# EAGLE schematic 3x8ButV1.3.6 (EAGLE 6.6.0)
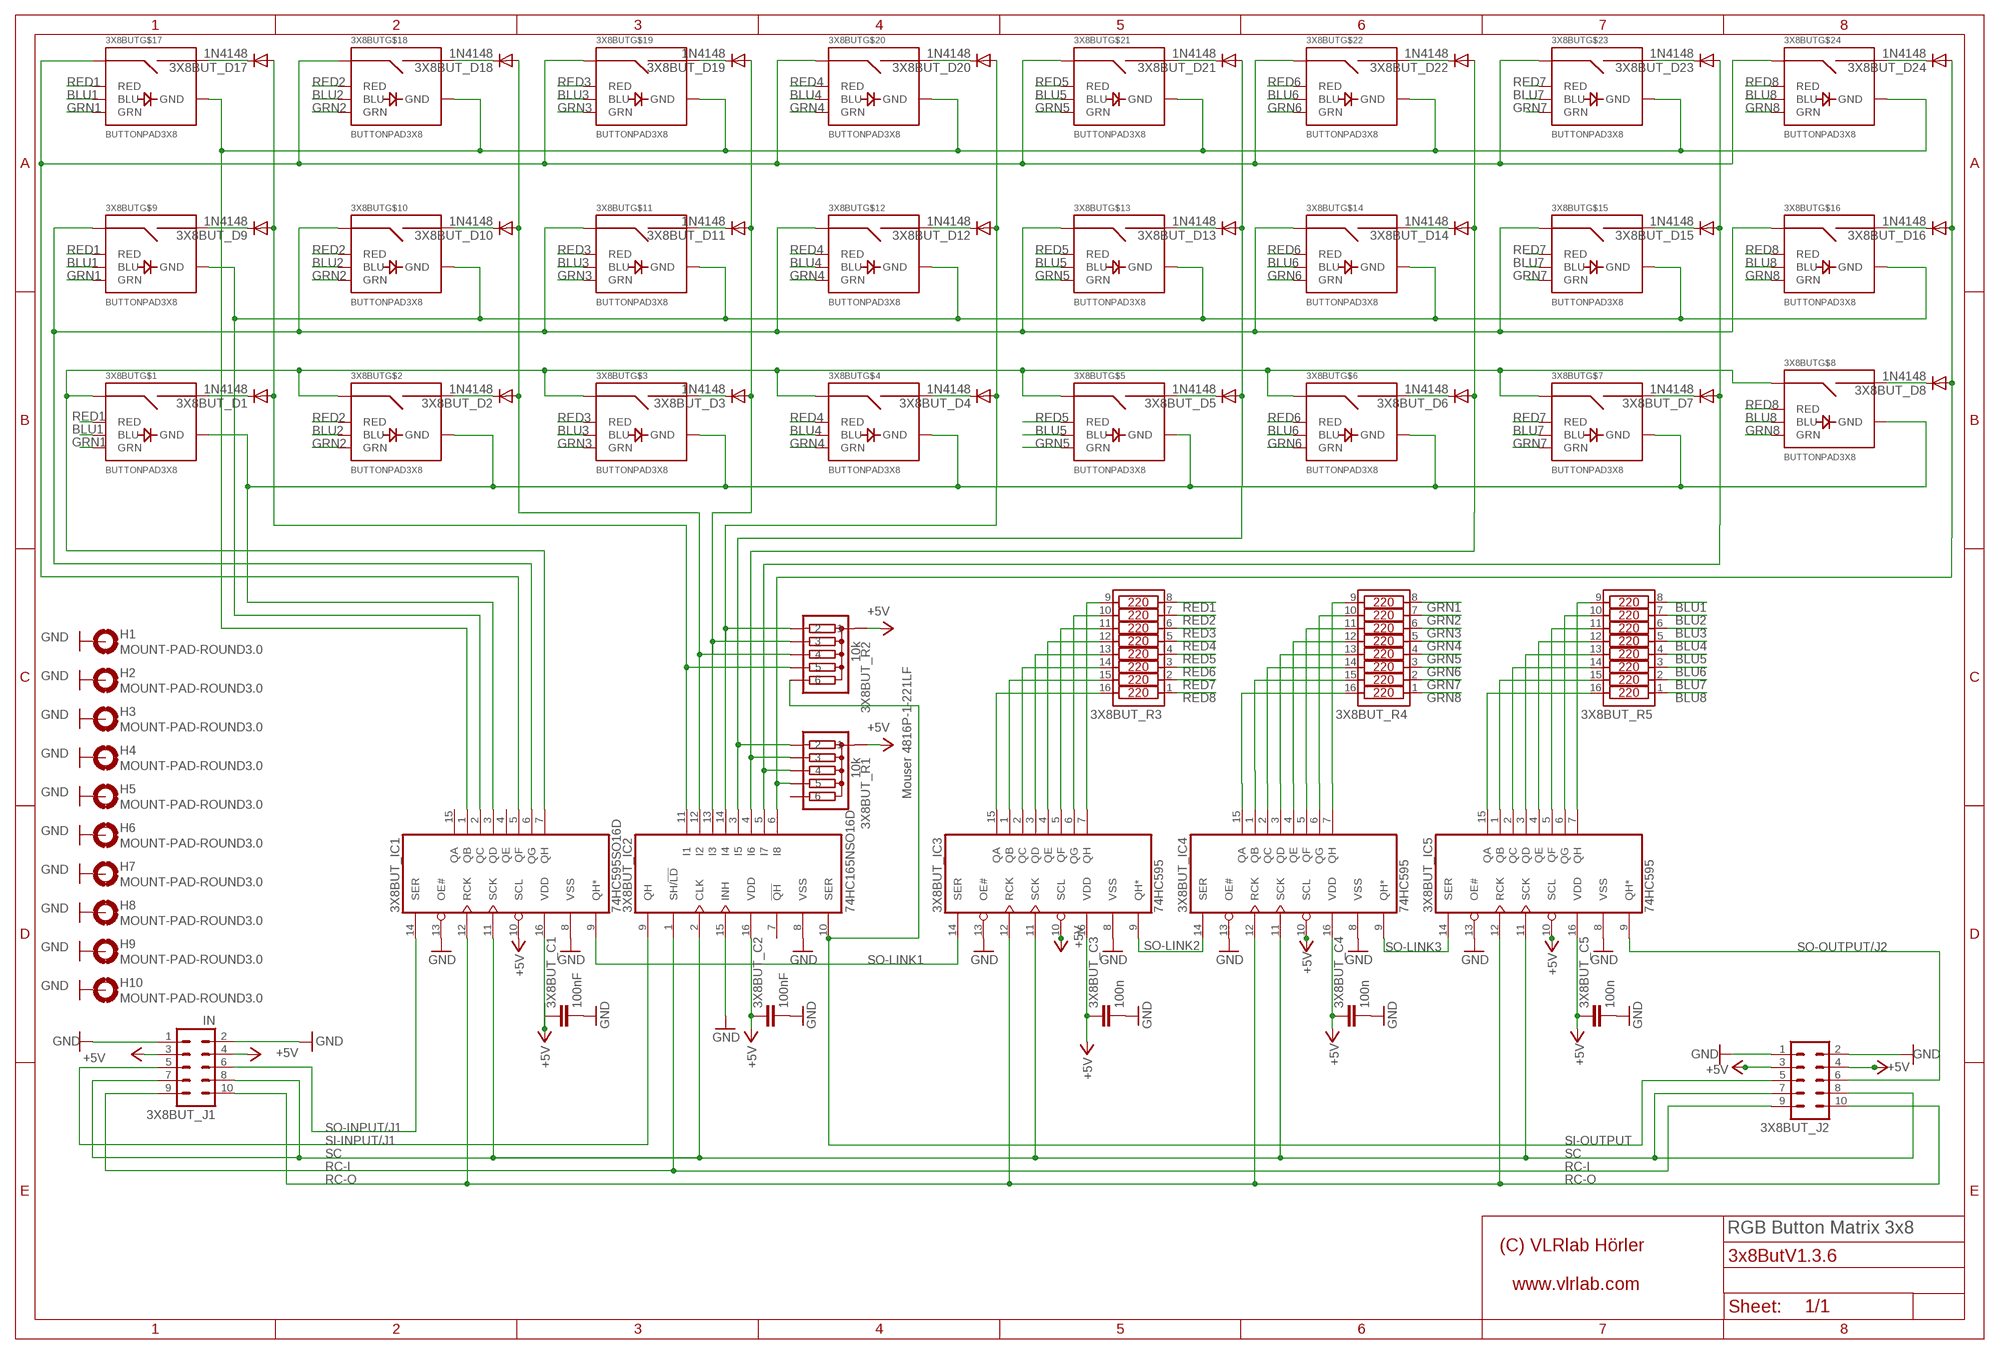
[diagram p0: schematic, sheet 1]

## Parts
3X8BUT  BUTTONPAD3X8  [BUTTONPAD3X8]
3X8BUT_C1  100nF  C-EU025-030X050  [C025-030X050]
3X8BUT_C2  100nF  C-EU025-030X050  [C025-030X050]
3X8BUT_C3  100n  C-EU025-030X050  [C025-030X050]
3X8BUT_C4  100n  C-EU025-030X050  [C025-030X050]
3X8BUT_C5  100n  C-EU025-030X050  [C025-030X050]
3X8BUT_D1  1N4148  [DO35-7]
3X8BUT_D2  1N4148  [DO35-7]
3X8BUT_D3  1N4148  [DO35-7]
3X8BUT_D4  1N4148  [DO35-7]
3X8BUT_D5  1N4148  [DO35-7]
3X8BUT_D6  1N4148  [DO35-7]
3X8BUT_D7  1N4148  [DO35-7]
3X8BUT_D8  1N4148  [DO35-7]
3X8BUT_D9  1N4148  [DO35-7]
3X8BUT_D10  1N4148  [DO35-7]
3X8BUT_D11  1N4148  [DO35-7]
3X8BUT_D12  1N4148  [DO35-7]
3X8BUT_D13  1N4148  [DO35-7]
3X8BUT_D14  1N4148  [DO35-7]
3X8BUT_D15  1N4148  [DO35-7]
3X8BUT_D16  1N4148  [DO35-7]
3X8BUT_D17  1N4148  [DO35-7]
3X8BUT_D18  1N4148  [DO35-7]
3X8BUT_D19  1N4148  [DO35-7]
3X8BUT_D20  1N4148  [DO35-7]
3X8BUT_D21  1N4148  [DO35-7]
3X8BUT_D22  1N4148  [DO35-7]
3X8BUT_D23  1N4148  [DO35-7]
3X8BUT_D24  1N4148  [DO35-7]
3X8BUT_IC1  74HC595SO16D  [SO16D]
3X8BUT_IC2  74HC165NSO16D  [SO16D]
3X8BUT_IC3  74HC595  74HC595SO16D  [SO16D]
3X8BUT_IC4  74HC595  74HC595SO16D  [SO16D]
3X8BUT_IC5  74HC595  74HC595SO16D  [SO16D]
3X8BUT_J1  IN  ML10  [ML10]
3X8BUT_J2  ML10  [ML10]
3X8BUT_R1  10k  4306R  [SIL6]
3X8BUT_R2  10k  4306R  [SIL6]
3X8BUT_R3  4816P-1SOIC16W  [SOIC16W]
3X8BUT_R4  4816P-1SOIC16W  [SOIC16W]
3X8BUT_R5  4816P-1SOIC16W  [SOIC16W]
H1  MOUNT-PAD-ROUND3.0  [3,0-PAD]
H2  MOUNT-PAD-ROUND3.0  [3,0-PAD]
H3  MOUNT-PAD-ROUND3.0  [3,0-PAD]
H4  MOUNT-PAD-ROUND3.0  [3,0-PAD]
H5  MOUNT-PAD-ROUND3.0  [3,0-PAD]
H6  MOUNT-PAD-ROUND3.0  [3,0-PAD]
H7  MOUNT-PAD-ROUND3.0  [3,0-PAD]
H8  MOUNT-PAD-ROUND3.0  [3,0-PAD]
H9  MOUNT-PAD-ROUND3.0  [3,0-PAD]
H10  MOUNT-PAD-ROUND3.0  [3,0-PAD]

## Nets
+5V [VDD]: 3X8BUT_C1.1 3X8BUT_C2.1 3X8BUT_C3.1 3X8BUT_C4.1 3X8BUT_C5.1 3X8BUT_IC1.10(SCL) 3X8BUT_IC1.16(VDD) 3X8BUT_IC2.16(VDD) 3X8BUT_IC3.10(SCL) 3X8BUT_IC3.16(VDD) 3X8BUT_IC4.10(SCL) 3X8BUT_IC4.16(VDD) 3X8BUT_IC5.10(SCL) 3X8BUT_IC5.16(VDD) 3X8BUT_J1.3 3X8BUT_J1.4 3X8BUT_J2.3 3X8BUT_J2.4 3X8BUT_R1.1 3X8BUT_R2.1
BLU1: 3X8BUT.BLU1(BLU) 3X8BUT.BLU9(BLU) 3X8BUT.BLU17(BLU) 3X8BUT_R5.8
BLU2: 3X8BUT.BLU2(BLU) 3X8BUT.BLU10(BLU) 3X8BUT.BLU18(BLU) 3X8BUT_R5.7
BLU3: 3X8BUT.BLU3(BLU) 3X8BUT.BLU11(BLU) 3X8BUT.BLU19(BLU) 3X8BUT_R5.6
BLU4: 3X8BUT.BLU4(BLU) 3X8BUT.BLU12(BLU) 3X8BUT.BLU20(BLU) 3X8BUT_R5.5
BLU5: 3X8BUT.BLU5(BLU) 3X8BUT.BLU13(BLU) 3X8BUT.BLU21(BLU) 3X8BUT_R5.4
BLU6: 3X8BUT.BLU6(BLU) 3X8BUT.BLU14(BLU) 3X8BUT.BLU22(BLU) 3X8BUT_R5.3
BLU7: 3X8BUT.BLU7(BLU) 3X8BUT.BLU15(BLU) 3X8BUT.BLU23(BLU) 3X8BUT_R5.2
BLU8: 3X8BUT.BLU8(BLU) 3X8BUT.BLU16(BLU) 3X8BUT.BLU24(BLU) 3X8BUT_R5.1
GND: 3X8BUT_C1.2 3X8BUT_C2.2 3X8BUT_C3.2 3X8BUT_C4.2 3X8BUT_C5.2 3X8BUT_IC1.8(VSS) 3X8BUT_IC1.13(OE#) 3X8BUT_IC2.8(VSS) 3X8BUT_IC2.15(INH) 3X8BUT_IC3.8(VSS) 3X8BUT_IC3.13(OE#) 3X8BUT_IC4.8(VSS) 3X8BUT_IC4.13(OE#) 3X8BUT_IC5.8(VSS) 3X8BUT_IC5.13(OE#) 3X8BUT_J1.1 3X8BUT_J1.2 3X8BUT_J2.1 3X8BUT_J2.2 H1.B3,0(MOUNT) H2.B3,0(MOUNT) H3.B3,0(MOUNT) H4.B3,0(MOUNT) H5.B3,0(MOUNT) H6.B3,0(MOUNT) H7.B3,0(MOUNT) H8.B3,0(MOUNT) H9.B3,0(MOUNT) H10.B3,0(MOUNT)
GND1: 3X8BUT.GND1(GND) 3X8BUT.GND2(GND) 3X8BUT.GND3(GND) 3X8BUT.GND4(GND) 3X8BUT.GND5(GND) 3X8BUT.GND6(GND) 3X8BUT.GND7(GND) 3X8BUT.GND8(GND) 3X8BUT_IC1.3(QD)
GND9: 3X8BUT.GND9(GND) 3X8BUT.GND10(GND) 3X8BUT.GND11(GND) 3X8BUT.GND12(GND) 3X8BUT.GND13(GND) 3X8BUT.GND14(GND) 3X8BUT.GND15(GND) 3X8BUT.GND16(GND) 3X8BUT_IC1.2(QC)
GND17: 3X8BUT.GND17(GND) 3X8BUT.GND18(GND) 3X8BUT.GND19(GND) 3X8BUT.GND20(GND) 3X8BUT.GND21(GND) 3X8BUT.GND22(GND) 3X8BUT.GND23(GND) 3X8BUT.GND24(GND) 3X8BUT_IC1.1(QB)
GRN1: 3X8BUT.GRN1(GRN) 3X8BUT.GRN9(GRN) 3X8BUT.GRN17(GRN) 3X8BUT_R4.8
GRN2: 3X8BUT.GRN2(GRN) 3X8BUT.GRN10(GRN) 3X8BUT.GRN18(GRN) 3X8BUT_R4.7
GRN3: 3X8BUT.GRN3(GRN) 3X8BUT.GRN11(GRN) 3X8BUT.GRN19(GRN) 3X8BUT_R4.6
GRN4: 3X8BUT.GRN4(GRN) 3X8BUT.GRN12(GRN) 3X8BUT.GRN20(GRN) 3X8BUT_R4.5
GRN5: 3X8BUT.GRN5(GRN) 3X8BUT.GRN13(GRN) 3X8BUT.GRN21(GRN) 3X8BUT_R4.4
GRN6: 3X8BUT.GRN6(GRN) 3X8BUT.GRN14(GRN) 3X8BUT.GRN22(GRN) 3X8BUT_R4.3
GRN7: 3X8BUT.GRN7(GRN) 3X8BUT.GRN15(GRN) 3X8BUT.GRN23(GRN) 3X8BUT_R4.2
GRN8: 3X8BUT.GRN8(GRN) 3X8BUT.GRN16(GRN) 3X8BUT.GRN24(GRN) 3X8BUT_R4.1
N$1: 3X8BUT.SIG34(SIG2) 3X8BUT_D17.C
N$2: 3X8BUT.SIG18(SIG2) 3X8BUT_D9.C
N$3: 3X8BUT.SIG02(SIG2) 3X8BUT_D1.C
N$4: 3X8BUT.SIG36(SIG2) 3X8BUT_D18.C
N$5: 3X8BUT.SIG20(SIG2) 3X8BUT_D10.C
N$6: 3X8BUT.SIG04(SIG2) 3X8BUT_D2.C
N$7: 3X8BUT.SIG38(SIG2) 3X8BUT_D19.C
N$8: 3X8BUT.SIG22(SIG2) 3X8BUT_D11.C
N$9: 3X8BUT_IC5.15(QA) 3X8BUT_R5.16
N$10: 3X8BUT_IC5.1(QB) 3X8BUT_R5.15
N$11: 3X8BUT_IC5.2(QC) 3X8BUT_R5.14
N$12: 3X8BUT_IC5.3(QD) 3X8BUT_R5.13
N$13: 3X8BUT_IC5.4(QE) 3X8BUT_R5.12
N$14: 3X8BUT_IC5.5(QF) 3X8BUT_R5.11
N$15: 3X8BUT_IC5.6(QG) 3X8BUT_R5.10
N$16: 3X8BUT_IC5.7(QH) 3X8BUT_R5.9
N$17: 3X8BUT_IC3.15(QA) 3X8BUT_R3.16
N$18: 3X8BUT_IC3.1(QB) 3X8BUT_R3.15
N$19: 3X8BUT_IC3.2(QC) 3X8BUT_R3.14
N$20: 3X8BUT_IC3.3(QD) 3X8BUT_R3.13
N$21: 3X8BUT_IC3.4(QE) 3X8BUT_R3.12
N$22: 3X8BUT_IC3.5(QF) 3X8BUT_R3.11
N$23: 3X8BUT_IC3.6(QG) 3X8BUT_R3.10
N$24: 3X8BUT_IC3.7(QH) 3X8BUT_R3.9
N$65: 3X8BUT_IC4.15(QA) 3X8BUT_R4.16
N$66: 3X8BUT_IC4.1(QB) 3X8BUT_R4.15
N$67: 3X8BUT_IC4.2(QC) 3X8BUT_R4.14
N$68: 3X8BUT_IC4.3(QD) 3X8BUT_R4.13
N$69: 3X8BUT_IC4.4(QE) 3X8BUT_R4.12
N$70: 3X8BUT_IC4.5(QF) 3X8BUT_R4.11
N$71: 3X8BUT_IC4.6(QG) 3X8BUT_R4.10
N$72: 3X8BUT_IC4.7(QH) 3X8BUT_R4.9
N$73: 3X8BUT.SIG06(SIG2) 3X8BUT_D3.C
N$74: 3X8BUT.SIG40(SIG2) 3X8BUT_D20.C
N$75: 3X8BUT.SIG24(SIG2) 3X8BUT_D12.C
N$76: 3X8BUT.SIG08(SIG2) 3X8BUT_D4.C
N$77: 3X8BUT.SIG42(SIG2) 3X8BUT_D21.C
N$78: 3X8BUT.SIG26(SIG2) 3X8BUT_D13.C
N$79: 3X8BUT.SIG10(SIG2) 3X8BUT_D5.C
N$80: 3X8BUT.SIG44(SIG2) 3X8BUT_D22.C
N$81: 3X8BUT.SIG28(SIG2) 3X8BUT_D14.C
N$82: 3X8BUT.SIG12(SIG2) 3X8BUT_D6.C
N$83: 3X8BUT.SIG14(SIG2) 3X8BUT_D7.C
N$84: 3X8BUT.SIG30(SIG2) 3X8BUT_D15.C
N$85: 3X8BUT.SIG46(SIG2) 3X8BUT_D23.C
N$86: 3X8BUT.SIG48(SIG2) 3X8BUT_D24.C
N$87: 3X8BUT.SIG32(SIG2) 3X8BUT_D16.C
N$88: 3X8BUT.SIG16(SIG2) 3X8BUT_D8.C
RC-I: 3X8BUT_IC2.1(SH/!LD) 3X8BUT_J1.9 3X8BUT_J2.9
RC-O: 3X8BUT_IC1.12(RCK) 3X8BUT_IC3.12(RCK) 3X8BUT_IC4.12(RCK) 3X8BUT_IC5.12(RCK) 3X8BUT_J1.10 3X8BUT_J2.10
RED1: 3X8BUT.RED1(RED) 3X8BUT.RED9(RED) 3X8BUT.RED17(RED) 3X8BUT_R3.8
RED2: 3X8BUT.RED2(RED) 3X8BUT.RED10(RED) 3X8BUT.RED18(RED) 3X8BUT_R3.7
RED3: 3X8BUT.RED3(RED) 3X8BUT.RED11(RED) 3X8BUT.RED19(RED) 3X8BUT_R3.6
RED4: 3X8BUT.RED4(RED) 3X8BUT.RED12(RED) 3X8BUT.RED20(RED) 3X8BUT_R3.5
RED5: 3X8BUT.RED5(RED) 3X8BUT.RED13(RED) 3X8BUT.RED21(RED) 3X8BUT_R3.4
RED6: 3X8BUT.RED6(RED) 3X8BUT.RED14(RED) 3X8BUT.RED22(RED) 3X8BUT_R3.3
RED7: 3X8BUT.RED7(RED) 3X8BUT.RED15(RED) 3X8BUT.RED23(RED) 3X8BUT_R3.2
RED8: 3X8BUT.RED8(RED) 3X8BUT.RED16(RED) 3X8BUT.RED24(RED) 3X8BUT_R3.1
ROW1: 3X8BUT_D1.A 3X8BUT_D9.A 3X8BUT_D17.A 3X8BUT_IC2.11(I1) 3X8BUT_R2.5
ROW2: 3X8BUT_D2.A 3X8BUT_D10.A 3X8BUT_D18.A 3X8BUT_IC2.12(I2) 3X8BUT_R2.4
ROW3: 3X8BUT_D3.A 3X8BUT_D11.A 3X8BUT_D19.A 3X8BUT_IC2.13(I3) 3X8BUT_R2.3
ROW4: 3X8BUT_D4.A 3X8BUT_D12.A 3X8BUT_D20.A 3X8BUT_IC2.14(I4) 3X8BUT_R2.2
ROW5: 3X8BUT_D5.A 3X8BUT_D13.A 3X8BUT_D21.A 3X8BUT_IC2.3(I5) 3X8BUT_R1.2
ROW6: 3X8BUT_D6.A 3X8BUT_D14.A 3X8BUT_D22.A 3X8BUT_IC2.4(I6) 3X8BUT_R1.3
ROW7: 3X8BUT_D7.A 3X8BUT_D15.A 3X8BUT_D23.A 3X8BUT_IC2.5(I7) 3X8BUT_R1.4
ROW8: 3X8BUT_D8.A 3X8BUT_D16.A 3X8BUT_D24.A 3X8BUT_IC2.6(I8) 3X8BUT_R1.5
SC: 3X8BUT_IC1.11(SCK) 3X8BUT_IC2.2(CLK) 3X8BUT_IC3.11(SCK) 3X8BUT_IC4.11(SCK) 3X8BUT_IC5.11(SCK) 3X8BUT_J1.7 3X8BUT_J1.8 3X8BUT_J2.7 3X8BUT_J2.8
SEL1: 3X8BUT.SIG01(SIG1) 3X8BUT.SIG03(SIG1) 3X8BUT.SIG05(SIG1) 3X8BUT.SIG07(SIG1) 3X8BUT.SIG09(SIG1) 3X8BUT.SIG11(SIG1) 3X8BUT.SIG13(SIG1) 3X8BUT.SIG15(SIG1) 3X8BUT_IC1.7(QH)
SEL2: 3X8BUT.SIG17(SIG1) 3X8BUT.SIG19(SIG1) 3X8BUT.SIG21(SIG1) 3X8BUT.SIG23(SIG1) 3X8BUT.SIG25(SIG1) 3X8BUT.SIG27(SIG1) 3X8BUT.SIG29(SIG1) 3X8BUT.SIG31(SIG1) 3X8BUT_IC1.6(QG)
SEL3: 3X8BUT.SIG33(SIG1) 3X8BUT.SIG35(SIG1) 3X8BUT.SIG37(SIG1) 3X8BUT.SIG39(SIG1) 3X8BUT.SIG41(SIG1) 3X8BUT.SIG43(SIG1) 3X8BUT.SIG45(SIG1) 3X8BUT.SIG47(SIG1) 3X8BUT_IC1.5(QF)
SI-INPUT/J1: 3X8BUT_IC2.9(QH) 3X8BUT_J1.5
SI-OUTPUT: 3X8BUT_IC2.10(SER) 3X8BUT_J2.5 3X8BUT_R2.6
SO-INPUT/J1: 3X8BUT_IC1.14(SER) 3X8BUT_J1.6
SO-LINK1: 3X8BUT_IC1.9(QH*) 3X8BUT_IC3.14(SER)
SO-LINK2: 3X8BUT_IC3.9(QH*) 3X8BUT_IC4.14(SER)
SO-LINK3: 3X8BUT_IC4.9(QH*) 3X8BUT_IC5.14(SER)
SO-OUTPUT/J2: 3X8BUT_IC5.9(QH*) 3X8BUT_J2.6
Unconnected: 3X8BUT_IC1.4(QE) 3X8BUT_IC1.15(QA) 3X8BUT_IC2.7(!QH) 3X8BUT_R1.6

## Notes on the sheet
- Mouser 4816P-1-221LF
- RGB Button Matrix 3x8

## Library data of the parts
3X8BUT = Rubberbutton:BUTTONPAD3X8
3X8BUT_C1-3X8BUT_C5 = rcl:C-EU: CAPACITOR, European symbol
3X8BUT_D1-3X8BUT_D24 = Diode:1N4148
3X8BUT_IC1 3X8BUT_IC3-3X8BUT_IC5 = 595-541-165-uln2803:74HC595
3X8BUT_IC2 = 595-541-165-uln2803:74HC165N
3X8BUT_J1 = con-harting-ml:ML10: HARTING; OC_FARNELL: unknown; OC_NEWARK: unknown
3X8BUT_J2 = con-ml:ML10: HARTING; OC_FARNELL: unknown; OC_NEWARK: unknown
3X8BUT_R1 3X8BUT_R2 = Bourns Resistor Array:4306R
3X8BUT_R3-3X8BUT_R5 = Bourns Resistor Array:4816P-1
H1-H10 = holes:MOUNT-PAD-ROUND: MOUNTING PAD, round

## Net classes
1 VDD: width 0.61 mm, drill 0.33 mm, clearance 0.355 mm to class 0, clearance 0.355 mm